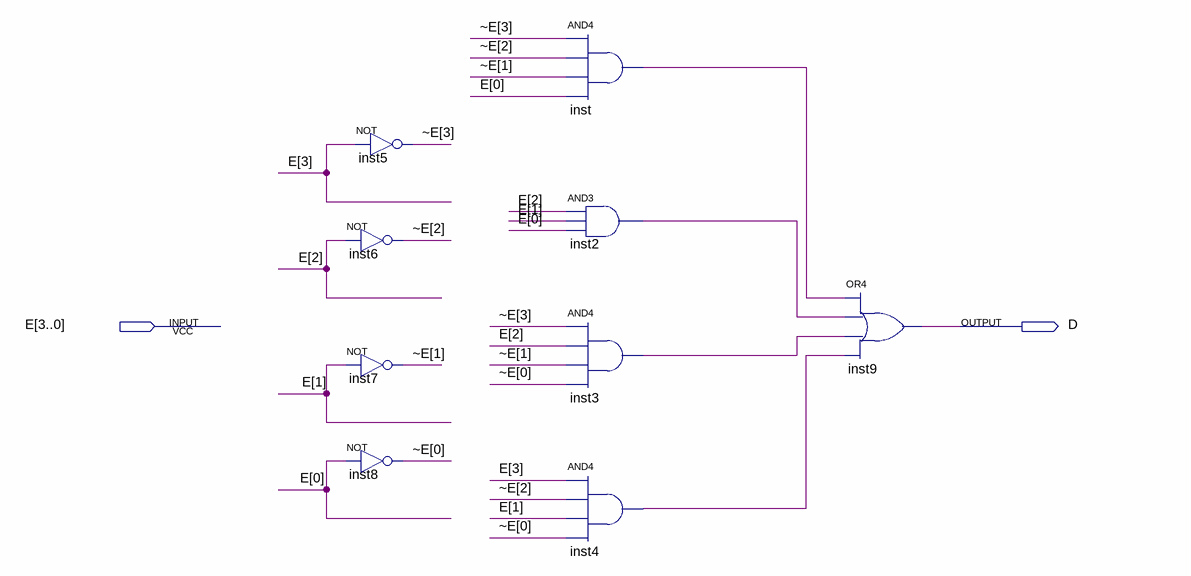
[diagram p0: schematic sheet]
// Quartus schematic seg_D.bdf as structural Verilog: 9 symbols, 2 pins
module seg_D (
  input  [3:0] E,
  output D
);

  wire inst2_out, inst3_out, inst4_out, inst_out;
  wire [3:0] \~E ;

  not inst5 (\~E [3], E[3]);
  not inst6 (\~E [2], E[2]);
  not inst7 (\~E [1], E[1]);
  not inst8 (\~E [0], E[0]);
  and inst (inst_out, \~E [3], \~E [2], \~E [1], E[0]);
  and inst2 (inst2_out, E[2], E[1], E[0]);
  and inst3 (inst3_out, \~E [3], E[2], \~E [1], \~E [0]);
  and inst4 (inst4_out, E[3], \~E [2], E[1], \~E [0]);
  or inst9 (D, inst_out, inst2_out, inst3_out, inst4_out);
endmodule
